# EAGLE design OpAmp-Inverting-3Transistor-alt2 (EAGLE 7.2.0)
Build an op amp with three discrete transistors Lyle Williams -December 01, 2011 http://www.edn.com/design/components-and-packaging/4368741/Build-an-op-amp-with-three-discrete-transistors
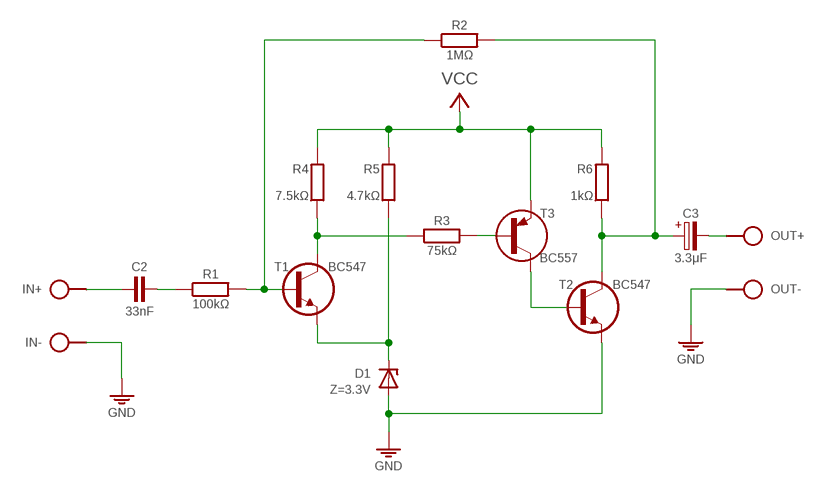
[diagram p0: schematic, sheet 1]

## Parts
C2  33nF  C050-020X044  [C050-020X044]
C3  3.3μF  CPOLE2,5-4/V  [E2.5-4/V]
D1  Z=3.3V  Z-DIODE34Z2,5  [DO34Z2,5]
IN  SPAD+--+  [SPAD-+]
J1  VCC_GNDPWR-R  [PWR-R]
OUT  SPAD+-+-  [SPAD+-]
R1  100kΩ  R-H0204/10-V  [0204/10-V]
R2  1MΩ  R-H0204/10  [0204/10]
R3  75kΩ  R-H0204/10  [0204/10]
R4  7.5kΩ  R0204/10  [0204/10]
R5  4.7kΩ  R0204/10  [0204/10]
R6  1kΩ  R0204/10-V  [0204/10-V]
T1  BC547  BC547CBE  [TO92-CBE]
T2  BC547  BC547CBE  [TO92-CBE]
T3  BC557  BC557CBE  [TO92-CBE]

## Nets
GND: D1.A IN.1 J1.1 OUT.1 T2.E
N$1: D1.C R5.1 T1.E
N$2: R3.1 R4.1 T1.C
N$3: T2.B T3.C
N$4: C2.2 IN.2
N$5: C2.1 R1.1
N$6: R1.2 R2.1 T1.B
N$7: R3.2 T3.B
N$8: C3.+ R2.2 R6.2 T2.C
N$9: C3.- OUT.2
VCC: J1.2 R4.2 R5.2 R6.1 T3.E

## Library data of the parts
C2 = c:C: CAPACITOR, European symbol
C3 = c:CPOL: POLARIZED CAPACITOR, European symbol
D1 = d:Z-DIODE
IN OUT = pad:SPAD+-
J1 = pad:VCC_GND
R1-R3 = r:R-H
R4-R6 = r:R: RESISTOR, European symbol
T1 T2 = t:BC547
T3 = t:BC557

## Board
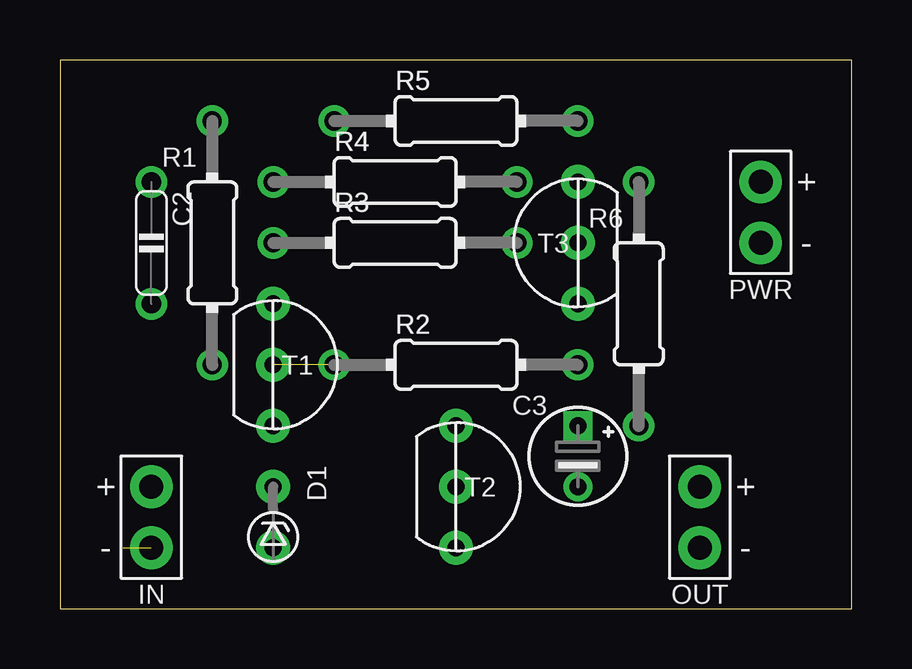
[diagram p1: board, top side]
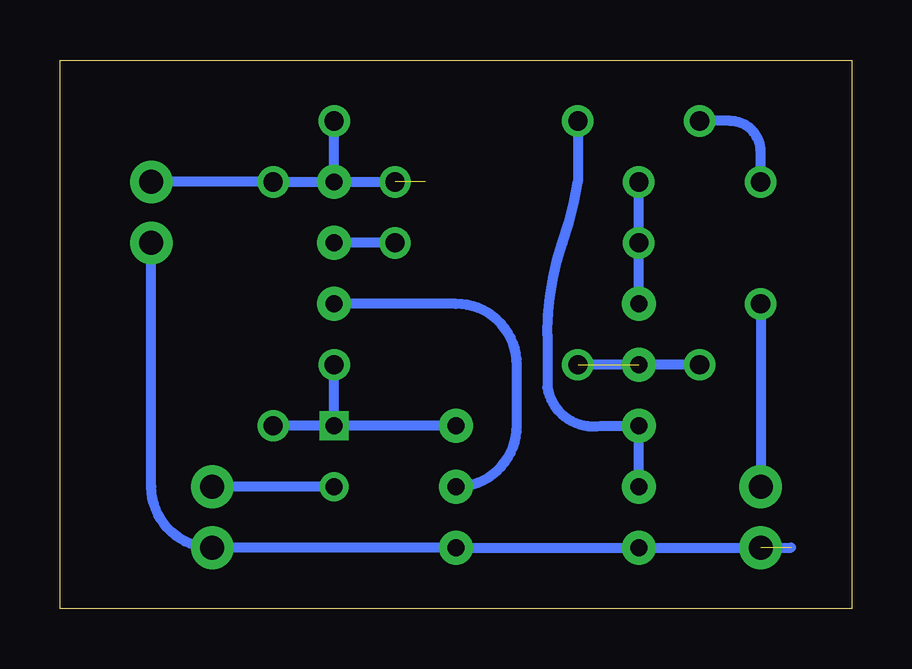
[diagram p2: board, bottom side, seen from below]

Size 33.02 x 22.86 mm. Coordinates in mm from the lower left corner, seen from the top.
Outline: 0,0 33.02,0 33.02,22.86 0,22.86 0,0
Copper layers (1*16): Top 0.035mm / dielectric 1.5mm / Bottom 0.035mm
Design rules "default": minimum track width 10mil, minimum drill 24mil, track to track 8mil, track to pad 8mil, pad to pad 8mil, via to via 8mil, smd to smd 8mil, copper to edge 40mil, drill to drill 8mil, minimum pad ring 10mil, minimum via ring 8mil, stop-mask expansion 4mil, vias tented up to drill 0mil, thermal gap 10mil

### Footprints (pad centres in the part's own frame; a part is rotated, then mirrored left to right if it is on the bottom)
C050-020X044 = drill 0.8: 1 -2.54,0; 2 2.54,0
E2.5-4/V = drill 0.7 square: + 0,1.27 | drill 0.7: - 0,-1.27
DO34Z2,5 = drill 0.7 pad 1.422: A 1.27,0; C -1.27,0
SPAD-+ = drill 1 pad 1.778: 1 0,-1.27; 2 0,1.27
PWR-R = drill 1 pad 1.778: 1 0,-1.27; 2 0,1.27
SPAD+- = drill 1 pad 1.778: 1 0,-1.27; 2 0,1.27
0204/10-V = drill 0.8: 1 0,5.08; 2 0,-5.08
0204/10 = drill 0.8: 1 -5.08,0; 2 5.08,0
TO92-CBE = drill 0.7 pad 1.422: B 0,0; C 0,2.54; E 0,-2.54

### Placement (x,y rotation side)
C2  3.81,15.24 270 top
C3  21.59,6.35 0 top
D1  8.89,3.81 270 top
IN  3.81,3.81 0 top
J1  29.21,16.51 0 top
OUT  26.67,3.81 0 top
R1  6.35,15.24 0 top
R2  16.51,10.16 0 top
R3  13.97,15.24 0 top
R4  13.97,17.78 0 top
R5  16.51,20.32 0 top
R6  24.13,12.7 0 top
T1  8.89,10.16 0 top
T2  16.51,5.08 0 top
T3  21.59,15.24 180 top

### Tracks (layer width: path | path; a pad name or v marks a point on that pad's centre or on a via)
GND  (1 unrouted)
  Bottom 0.406: J1.1 29.21,5.08 arc-90 OUT.1 T2.E D1.A 2.54,2.54
N$1
  Bottom 0.406: R5.1 11.43,17.78 arc10 12.07,15.24 arc-19 12.7,11.43 12.7,9.21 arc-90 10.48,7.62 T1.E D1.C
N$2
  Bottom 0.406: T1.C R3.1 R4.1
N$3
  Bottom 0.406: T2.B arc-90 13.97,7.62 13.97,10.16 arc-90 16.51,12.7 T3.C
N$4
  Bottom 0.406: C2.2 IN.2
N$5
  Bottom 0.406: C2.1 3.81,19.05 arc-90 5.08,20.32 R1.1
N$6  (1 unrouted)
  Bottom 0.406: R1.2 R2.1
N$7
  Bottom 0.406: R3.2 T3.B
N$8
  Bottom 0.406: T2.C C3.+ | C3.+ R2.2 | C3.+ R6.2
N$9
  Bottom 0.406: C3.- OUT.2
VCC  (1 unrouted)
  Bottom 0.406: J1.2 R6.1 T3.E | T3.E R5.2 | T3.E R4.2